# Altium project encoder-mjf.PrjPcb
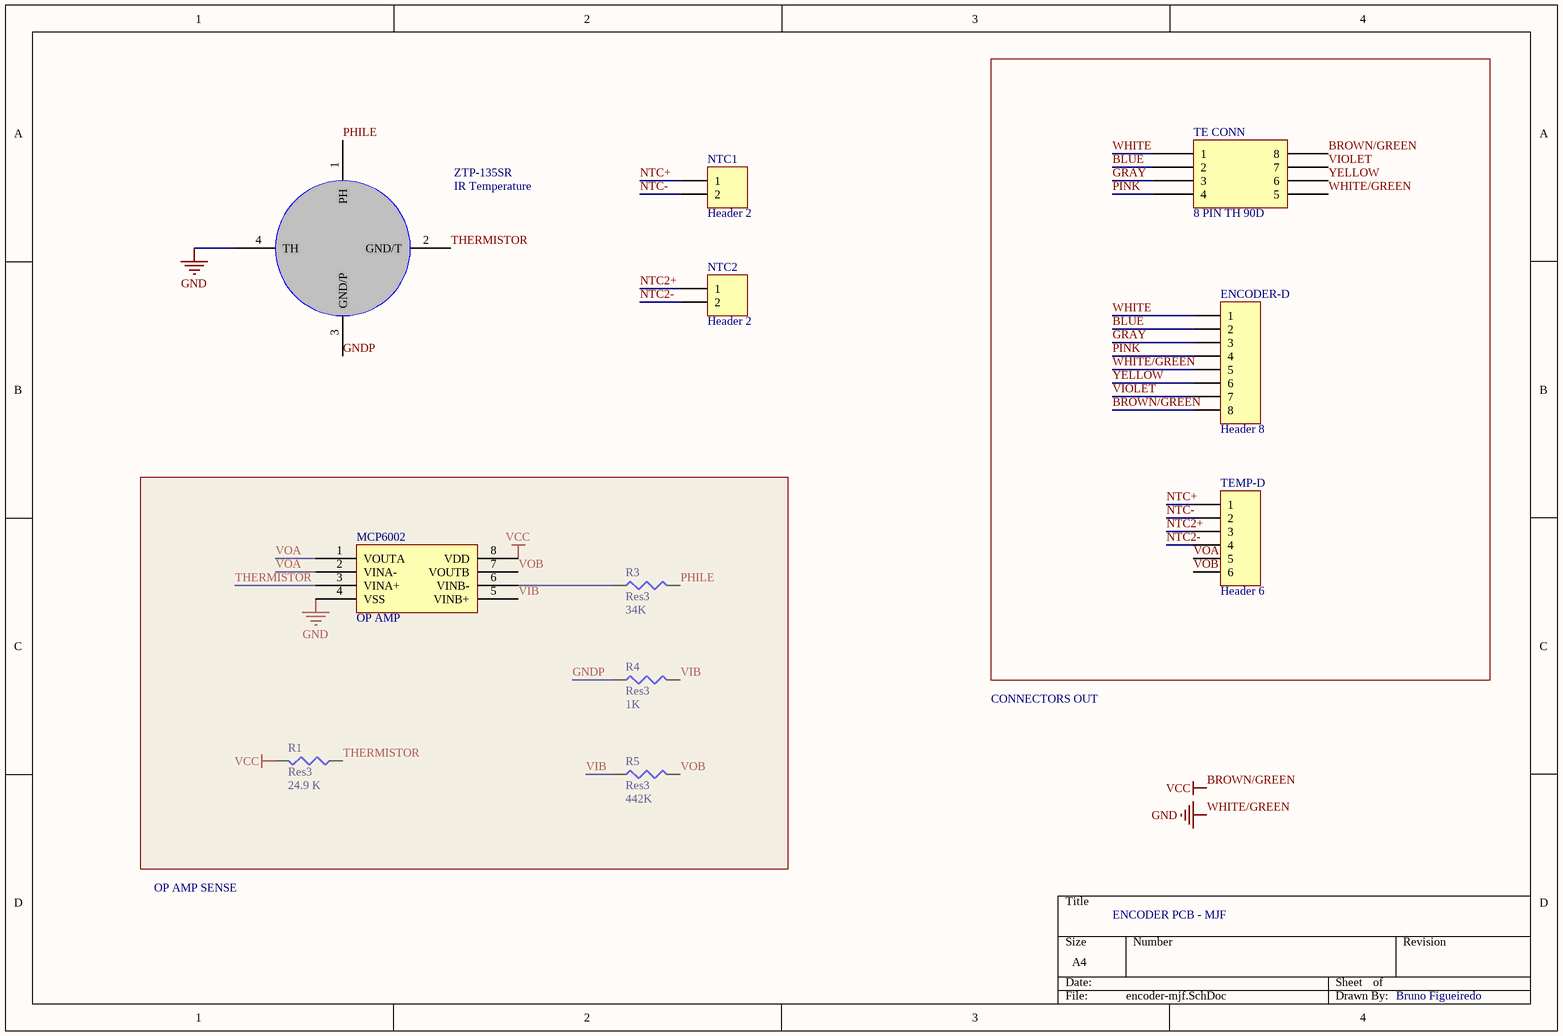
[diagram p0: encoder-mjf.SchDoc]
1 sheet, 11 parts. Net scope: global (net labels, ports and power ports of the same name join across sheets).
Board file: encoder-mjf.PcbDoc

## Sheet encoder-mjf.SchDoc
size A4

### Parts
ENCODER-D  Header 8  [HDR1X8]
MCP6002  OP AMP  [DIP-8]
NTC1  Header 2  [HDR1X2]
NTC2  Header 2  [HDR1X2]
R1  Res3  value 24.9 K  [J1-0603]
R3  Res3  value 34K  [J1-0603]
R4  Res3  value 1K  [J1-0603]
R5  Res3  value 442K  [C1206]
TE_CONN  8 PIN TH 90D  [NG_CD_2172077]
TEMP-D  Header 6  [HDR1X6]
ZTP-135SR  IR Temperature  [ZTP-135SR]

### Nets
BROWN/GREEN: ENCODER-D.8 MCP6002.8(VDD) R1.2 TE_CONN.8  [also labelled VCC]
WHITE/GREEN: ENCODER-D.5 MCP6002.4(VSS) TE_CONN.5 ZTP-135SR.4(TH)  [also labelled GND]
BLUE: ENCODER-D.2 TE_CONN.2
GNDP: R4.1 ZTP-135SR.3(GND/P)
GRAY: ENCODER-D.3 TE_CONN.3
NTC2+: NTC2.1 TEMP-D.3
NTC2-: NTC2.2 TEMP-D.4
NTC+: NTC1.1 TEMP-D.1
NTC-: NTC1.2 TEMP-D.2
PHILE: R3.2 ZTP-135SR.1(PH)
PINK: ENCODER-D.4 TE_CONN.4
THERMISTOR: MCP6002.3(VINA+) R1.1 ZTP-135SR.2(GND/T)
VIB: MCP6002.5(VINB+) R4.2 R5.1
VIOLET: ENCODER-D.7 TE_CONN.7
VOA: MCP6002.1(VOUTA) MCP6002.2(VINA-) TEMP-D.5
VOB: MCP6002.7(VOUTB) R5.2 TEMP-D.6
WHITE: ENCODER-D.1 TE_CONN.1
YELLOW: ENCODER-D.6 TE_CONN.6
NetMCP6002_6: MCP6002.6(VINB-) R3.1

### Notes on the sheet
- CONNECTORS OUT
- OP AMP SENSE
- ENCODER PCB - MJF
- Bruno Figueiredo

### Library data of the parts
ENCODER-D = Header 8: Header, 8-Pin; LatestRevisionDate: 17-Jul-2002; LatestRevisionNote: Re-released for DXP Platform.; Publisher: Altium Limited
MCP6002 = MCP6002-I/P
NTC1 NTC2 = Header 2: Header, 2-Pin; LatestRevisionDate: 17-Jul-2002; LatestRevisionNote: Re-released for DXP Platform.; Publisher: Altium Limited
R1 R3-R5 = Res3: Resistor; Published: 8-Jun-2000; LatestRevisionDate: 29-May-2009; LatestRevisionNote: IPC-7351 Footprint Added.; PackageReference: J1-0603; Publisher: Altium Limited; PackageDescription: Chip Resistor
TE_CONN = NG-CD-2172077
TEMP-D = Header 6: Header, 6-Pin; LatestRevisionDate: 17-Jul-2002; LatestRevisionNote: Re-released for DXP Platform.; Publisher: Altium Limited
ZTP-135SR = ZTP-135SR: Thermistor + Thermophile